# EAGLE schematic RAC (EAGLE 7.4.0)
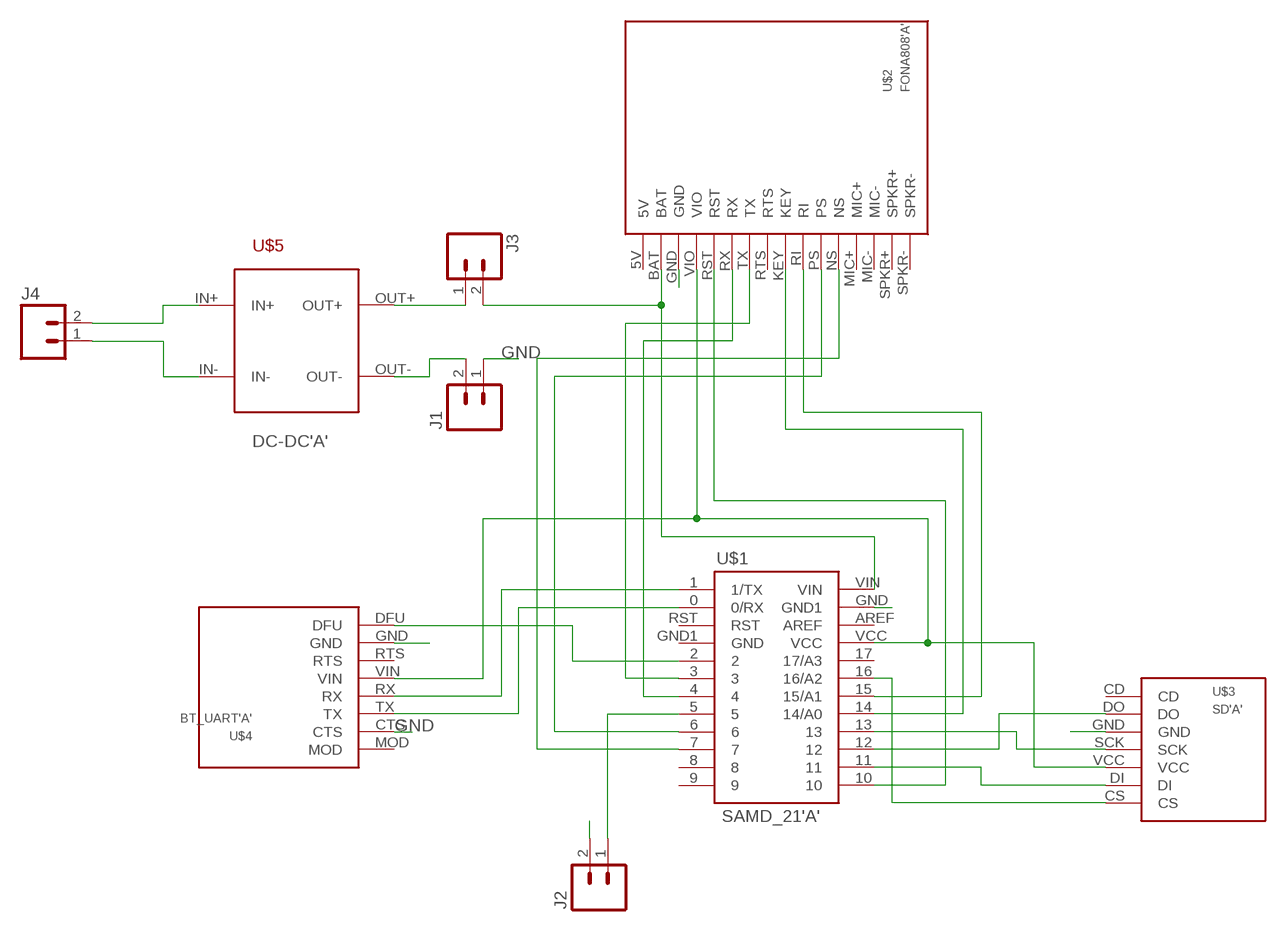
[diagram p0: schematic, sheet 1]

## Parts
J1  M02PTH  [1X02]
J2  M02PTH  [1X02]
J3  M02PTH  [1X02]
J4  M025MM  [SCREWTERMINAL-5MM-2]
U$1  SAMD_21'A'  [MINI]
U$2  FONA808'A'  [FONA]
U$3  SD'A'  [SD_BR]
U$4  BT_UART'A'  [BLE]
U$5  DC-DC'A'  [DC-DC]

## Nets
GND: J1.1 J2.2 U$1.GND(GND1) U$2.GND U$3.GND U$4.CTS U$4.GND
N$1: J3.2 U$1.VIN U$2.BAT
N$2: U$1.4 U$2.RX
N$3: U$1.3 U$2.TX
N$4: U$1.VCC U$2.VIO U$3.VCC U$4.VIN
N$5: U$1.14(14/A0) U$2.KEY
N$6: U$1.15(15/A1) U$2.RI
N$7: U$1.10 U$2.RST
N$8: U$1.6 U$2.PS
N$9: U$1.7 U$2.NS
N$10: U$1.11 U$3.DI
N$11: U$1.12 U$3.DO
N$12: U$1.13 U$3.SCK
N$13: U$1.16(16/A2) U$3.CS
N$14: J2.1 U$1.5
N$17: U$1.0(0/RX) U$4.TX
N$18: U$1.1(1/TX) U$4.RX
N$19: U$1.2 U$4.DFU
N$20: J3.1 U$5.OUT+
N$21: J1.2 U$5.OUT-
N$22: J4.2 U$5.IN+
N$23: J4.1 U$5.IN-
Unconnected: U$1.8 U$1.9 U$1.17(17/A3) U$1.AREF U$1.GND1(GND) U$1.RST U$2.5V U$2.MIC+ U$2.MIC- U$2.RTS U$2.SPKR+ U$2.SPKR- U$3.CD U$4.MOD U$4.RTS

## Library data of the parts
J1-J3 = SparkFun-Connectors:M02: Standard 2-pin 0.1" header. Use with - straight break away headers ( PRT-00116) - right angle break away headers (PRT-00553) - swiss pins (PRT-00743) - machine pins (PRT-00117) - female headers (PRT-00115) Molex polarized connector foot print use with: PRT-08233 with associated crimp pins and housings. 2.54_SCREWTERM for use with PRT-10571. 3.5mm Screw Terminal footprints for PRT-08084 5mm Screw Terminal footprints for use with PRT-08432
J4 = SparkFun-Connectors:M02: Standard 2-pin 0.1" header. Use with - straight break away headers ( PRT-00116) - right angle break away headers (PRT-00553) - swiss pins (PRT-00743) - machine pins (PRT-00117) - female headers (PRT-00115) Molex polarized connector foot print use with: PRT-08233 with associated crimp pins and housings. 2.54_SCREWTERM for use with PRT-10571. 3.5mm Screw Terminal footprints for PRT-08084 5mm Screw Terminal footprints for use with PRT-08432; STOREFRONT_ID: PRT-08432
U$1 = rac:SAMD_21: samd21
U$2 = rac:FONA808
U$3 = rac:SD
U$4 = rac:BT_UART
U$5 = rac:DC-DC